# EAGLE design maus-blenano2-mk-1.0.0 (EAGLE 7.5.0)
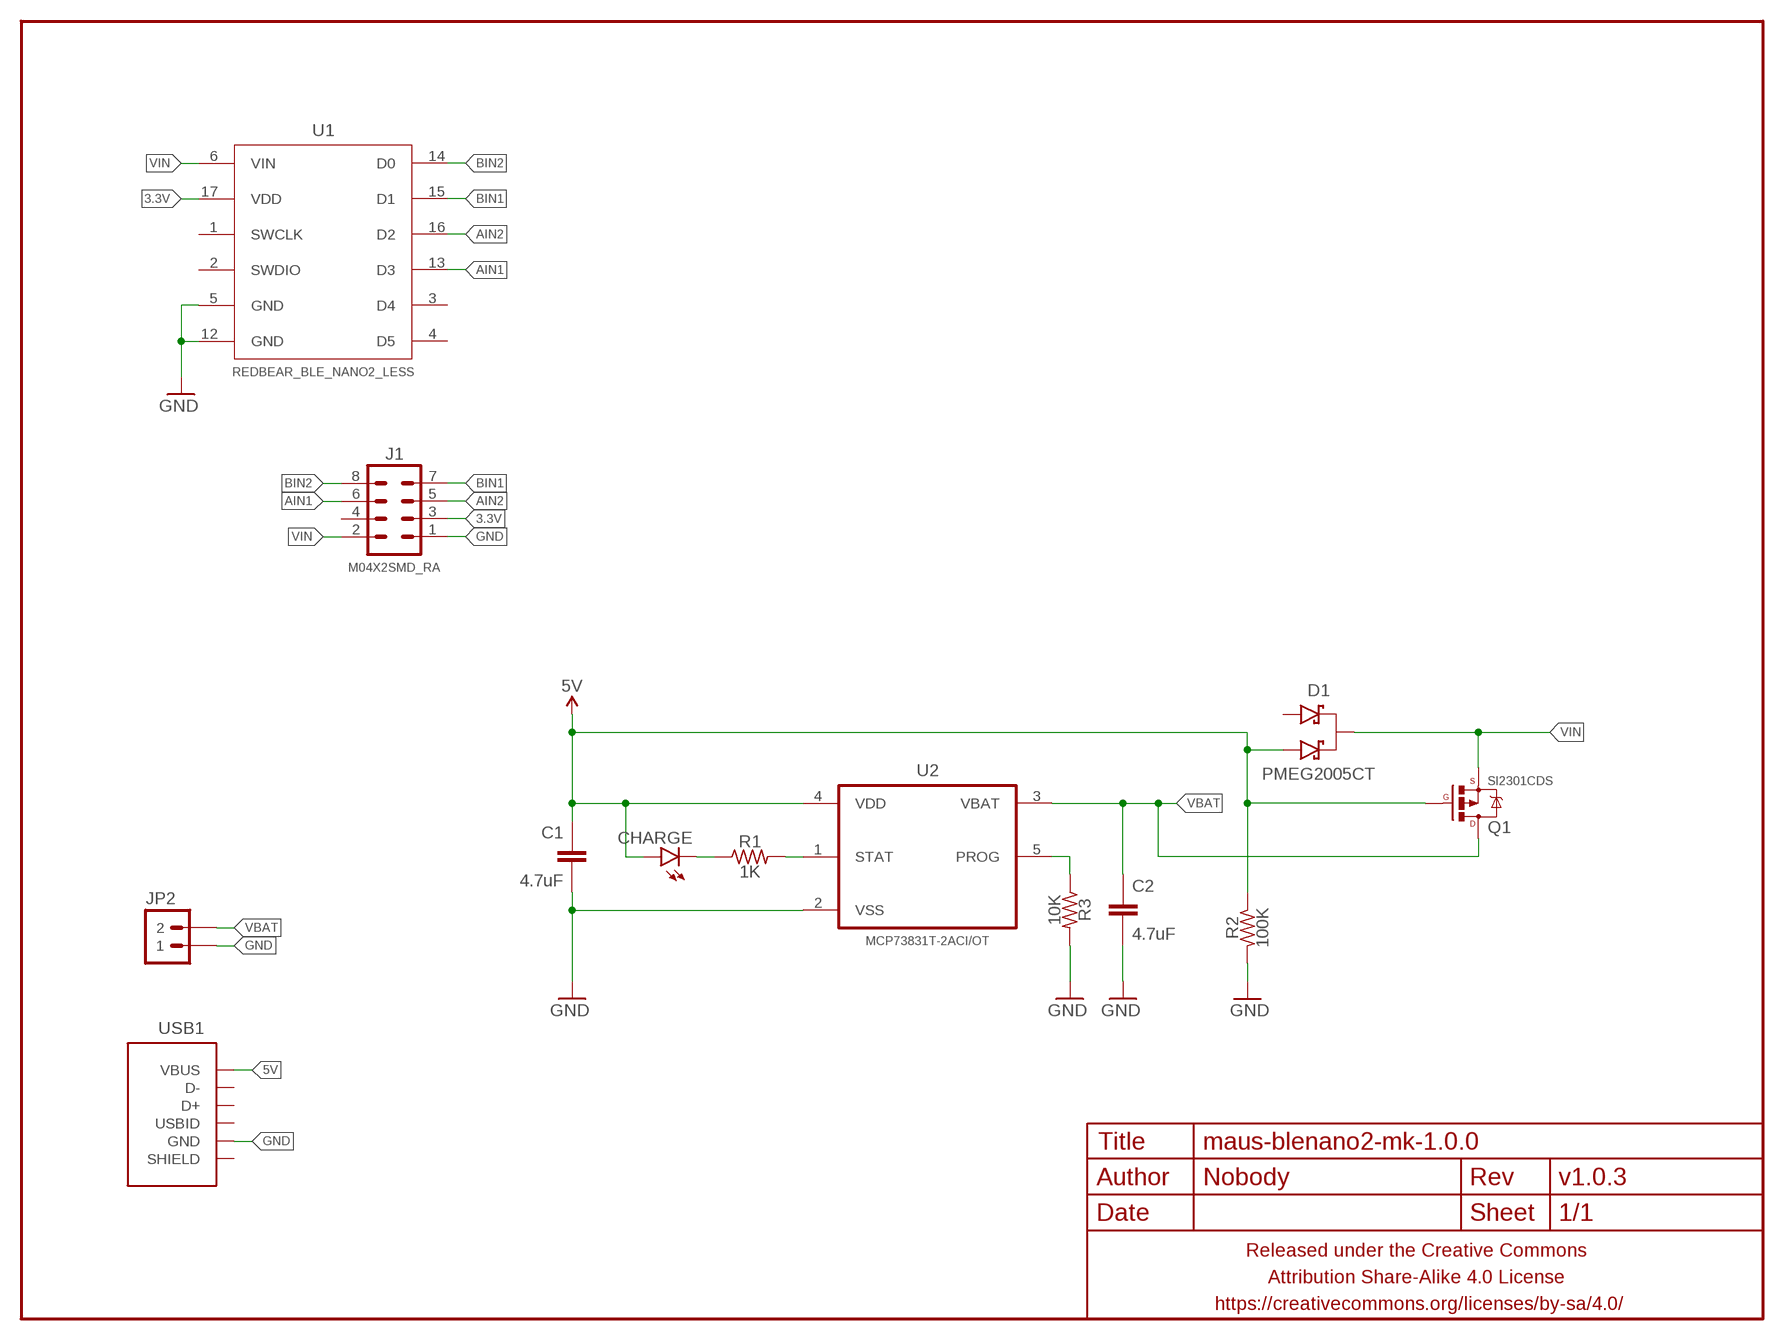
[diagram p0: schematic, sheet 1]

## Parts
C1  4.7uF  CAPACITOR-CERAMICC0603-TIGHTER  [C0603-TIGHTER]
C2  4.7uF  CAPACITOR-CERAMICC0603-TIGHTER  [C0603-TIGHTER]
CHARGE  LED0603-TIGHT  [LED-0603-TIGHT]
D1  PMEG2005CT  DIODE-SCHOTTKY-DUALPMEG2005CT  [SOT23]
FRAME1  FRAME-LETTERNO_PACKAGE  [DUMMY]
J1  M04X2SMD_RA  [2X4_SMD_RA]
JP2  M02JST-SH-VERT  [JST-2-SH-VERT]
Q1  SI2301CDS  MOSFET-PCHANNELSOT-23  [SOT23]
R1  1K  RESISTORR0603-TIGHTER  [R0603-TIGHTER]
R2  100K  RESISTORR0603-TIGHTER  [R0603-TIGHTER]
R3  10K  RESISTORR0603-TIGHTER  [R0603-TIGHTER]
U1  REDBEAR_BLE_NANO2_LESS  [REDBEAR_BLE_NANO2_LESS]
U2  MCP73831T-2ACI/OT  [SOT95P280X145-5N]
USB1  USB-AB-SHIELDZX80-B-5P_VERTICAL_SMD  [ZX80-B-5P-30]

## Nets
3.3V: J1.3 U1.17(VDD)
5V: C1.1 CHARGE.A D1.2(A2) Q1.1(G) R2.1 U2.4(VDD) USB1.5(VBUS)
AIN1: J1.6 U1.13(D3)
AIN2: J1.5 U1.16(D2)
BIN1: J1.7 U1.15(D1)
BIN2: J1.8 U1.14(D0)
GND: C1.2 C2.2 J1.1 JP2.1 R2.2 R3.2 U1.5(GND) U1.12(GND) U2.2(VSS) USB1.1(GND)
N$1: R1.2 U2.1(STAT)
N$2: CHARGE.C R1.1
N$11: R3.1 U2.5(PROG)
VBAT: C2.1 JP2.2 Q1.3(D) U2.3(VBAT)
VIN: D1.3(K) J1.2 Q1.2(S) U1.6(VIN)
Unconnected: D1.1(A1) J1.4 U1.1(SWCLK) U1.2(SWDIO) U1.3(D4) U1.4(D5) USB1.2(USBID) USB1.3(D+) USB1.4(D-) USB1.P$1(SHIELD) USB1.P$2(SHIELD) USB1.P$3(SHIELD) USB1.P$4(SHIELD)

## Library data of the parts
C1 C2 = a_parts:CAPACITOR-CERAMIC: CAPACITOR, European symbol
CHARGE = a_parts:LED: LEDs Standard schematic elements and footprints for 5mm, 3mm, 1206, and 0603 sized LEDs. 5mm - Spark Fun Electronics SKU : COM-00529 (and others)
D1 = a_parts:DIODE-SCHOTTKY-DUAL
FRAME1 = a_parts:FRAME-LETTER: Schematic Frame Standard 8.5x11 US Letter frame; DESIGNER: Nobody; VERSION: v1.0.3
J1 = a_parts:M04X2
JP2 = a_parts:M02: Standard 2-pin 0.1" header. Use with - straight break away headers ( PRT-00116) - right angle break away headers (PRT-00553) - swiss pins (PRT-00743) - machine pins (PRT-00117) - female headers (PRT-00115) Molex polarized connector foot print use with: PRT-08233 with associated crimp pins and housings. 2.54_SCREWTERM for use with PRT-10571. 3.5mm Screw Terminal footprints for PRT-08084 5mm Screw Terminal footprints for use with PRT-08433
Q1 = a_parts:MOSFET-PCHANNEL: Generic PMOSFET IRLML2244 - TRANS-11153 (SOT-23 -20V -4.3A) (1.Gate 2.Source 3.Drain) FQP27P06 - COM-10349 <http://www.sparkfun.com/products/10349> (TO-220 -60V -27A) (1.Gate 2.Source 3.Drain)
R1-R3 = a_parts:RESISTOR: RESISTOR, American symbol
U1 = a_parts:REDBEAR_BLE_NANO2_LESS
U2 = a_parts:MCP73831T-2ACI/OT: Charge Management Controller; MPN: MCP73831T-2ACI/OT; OC_FARNELL: 1332158; OC_NEWARK: 56K7045; PACKAGE: SOT-5; SUPPLIER: Microchip
USB1 = a_parts:USB-AB-SHIELD

## Board
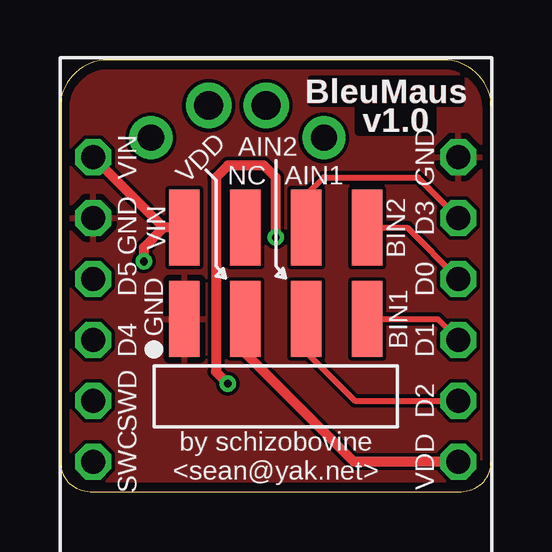
[diagram p1: board, top side]
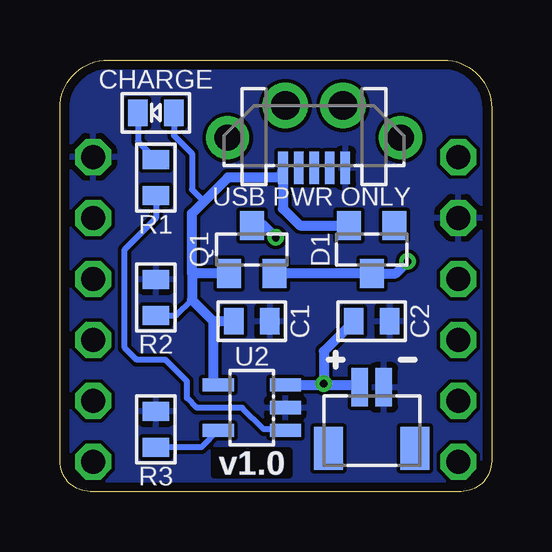
[diagram p2: board, bottom side, seen from below]

Size 18 x 18 mm. Coordinates in mm from the lower left corner, seen from the top.
Outline: 1.27,0 16.73,0 arc90 18,1.27 18,16 arc90 16,18 2,18 arc90 0,16 0,1.27 arc90 1.27,0
Copper layers (1*16): Top 0.0356mm / dielectric 1.5011mm / Bottom 0.0356mm
Design rules "LaenPCBOrder2": minimum track width 6mil, minimum drill 13mil, track to track 6mil, track to pad 6mil, pad to pad 6mil, via to via 6mil, smd to smd 6mil, copper to edge 15mil, drill to drill 6mil, minimum pad ring 7mil, minimum via ring 7mil, stop-mask expansion 3mil, vias tented up to drill 20mil, thermal gap 10mil

### Footprints (pad centres in the part's own frame; a part is rotated, then mirrored left to right if it is on the bottom)
C0603-TIGHTER = smd 0.8 x 1.1: 1 -0.75,0; 2 0.75,0
LED-0603-TIGHT = smd 0.8 x 1.1: A 0.75,0; C -0.75,0
SOT23 = smd 1 x 1.2: 1 -0.95,-1; 2 0.95,-1; 3 0,1
2X4_SMD_RA = smd 1.27 x 3.175: 1 3.81,1.905; 2 3.81,-1.905; 3 1.27,1.905; 4 1.27,-1.905; 5 -1.27,1.905; 6 -1.27,-1.905; 7 -3.81,1.905; 8 -3.81,-1.905
JST-2-SH-VERT = smd 0.7 x 1.6: 1 -0.5,0.75; 2 0.5,0.75 | smd 1.2 x 1.8: P$1 -1.8,3.3; P$2 1.8,3.3
R0603-TIGHTER = smd 0.8 x 1.1: 1 -0.75,0; 2 0.75,0
REDBEAR_BLE_NANO2_LESS = drill 1 octagon: 1 7.62,6.35; 2 7.62,3.81; 3 7.62,1.27; 4 7.62,-1.27; 5 7.62,-3.81; 6 7.62,-6.35; 12 -7.62,-6.35; 13 -7.62,-3.81; 14 -7.62,-1.27; 15 -7.62,1.27; 16 -7.62,3.81; 17 -7.62,6.35
SOT95P280X145-5N = smd 1.3 x 0.55: 1 -1.4,0.95; 2 -1.4,0; 3 -1.4,-0.95; 4 1.4,-0.95; 5 1.4,0.95
ZX80-B-5P-30 = smd 0.4 x 1.35: 1 -1.3,2.6; 2 -0.65,2.6; 3 0,2.6; 4 0.65,2.6; 5 1.3,2.6 | drill 1.1 pad 1.8: P$1 -3.61,1.34; P$4 3.61,1.34 | drill 1.2 pad 1.9: P$2 -1.2,0; P$3 1.2,0

### Placement (x,y rotation side)
C1  10,7.1 0 bottom
C2  5,7.1 0 bottom
CHARGE  14,15.8 0 bottom
D1  5,10.1 180 bottom
FRAME1  0,0 0 top
J1  9,9.1 180 top
JP2  5,5.1 180 bottom
Q1  10,10.1 0 bottom
R1  14,13.1 270 bottom
R2  14,8.1 90 bottom
R3  14,2.6 90 bottom
U1  9,7.6 180 top
U2  10,3.5 180 bottom
USB1  7.4,16.1 180 bottom

### Tracks (layer width: path | path; a pad name or v marks a point on that pad's centre or on a via)
3.3V
  Top 0.406: J1.3 7.73,5.77 12.25,1.25 U1.17
5V
  Bottom 0.254: CHARGE.A 13.25,14.85 12.5,14.1 12.5,12.6 12,12.1 | 14,7.1 R2.1 13.15,7.35 12.5,8
  Bottom 0.406: D1.2 8,11.1 8.7,11.8 USB1.5 8.8,13.1 11,13.1 12,12.1 12.5,11.6 12.5,9.1 | 11,9.1 Q1.1 12.5,9.1 | C1.1 11.6,7.1 | 11.6,7.1 12.5,8 12.5,9.1 | U2.4 11.6,4.45 11.6,7.1
AIN1
  Top 0.254: J1.6 10.27,12.37 11,13.1 14.93,13.1 U1.13
AIN2
  Top 0.254: J1.5 10.27,5.83 12.31,3.79 U1.16
BIN1
  Top 0.254: J1.7 15.76,7.2 U1.15
BIN2
  Top 0.254: J1.8 14.48,11.01 U1.14
GND
  pour Top (rank 6): 1.27,0 16.73,0 arc90 18,1.27 18,16 arc90 16,18 2,18 arc90 0,16 0,1.27 arc90
  pour Bottom (rank 6): 1.27,0 16.73,0 arc90 18,1.27 18,16 arc90 16,18 2,18 arc90 0,16 0,1.27 arc90
N$1
  Bottom 0.254: U2.1 8.65,2.6 9.5,2.6 10.4,3.5 12.3,3.5 12.7,3.9 12.7,4.6 13.6,5.5 14.8,5.5 15.3,6 15.3,10.1 14,11.4 R1.2
N$2
  Bottom 0.254: CHARGE.C 14.75,14.6 R1.1
N$11
  Bottom 0.254: U2.5 12.1,1.85 R3.1
VBAT  (via drill 0.33)
  Top 0.406: v9,10.6 9,13.1 8.5,13.6 7,13.6 6.5,13.1 6.5,5 v7,4.5
  Bottom 0.406: Q1.3 9.5,11.1 v9,10.6 | U2.3 7,4.45 | 7,4.45 5.5,4.45 JP2.2 | 7,4.45 v7,4.5 7,5.85 C2.1
VIN  (via drill 0.33)
  Top 0.406: 4.33,11.01 U1.6 | J1.2 4.33,11.01 | v3.5,9.6 3.5,10.18 4.33,11.01
  Bottom 0.406: v3.5,9.6 4,9.1 D1.3 Q1.2

### Text on the board
Top: BleuMaus
tPlace: BleuMaus | by schizobovine / <sean@yak.net>
bPlace: USB PWR ONLY
tNames: AIN2 | VDD | NC | AIN1 | VIN | BIN2 | GND | BIN1